# EAGLE design Pure VCO (EAGLE 9.6.2)

## Sheet 1 of 6: Core
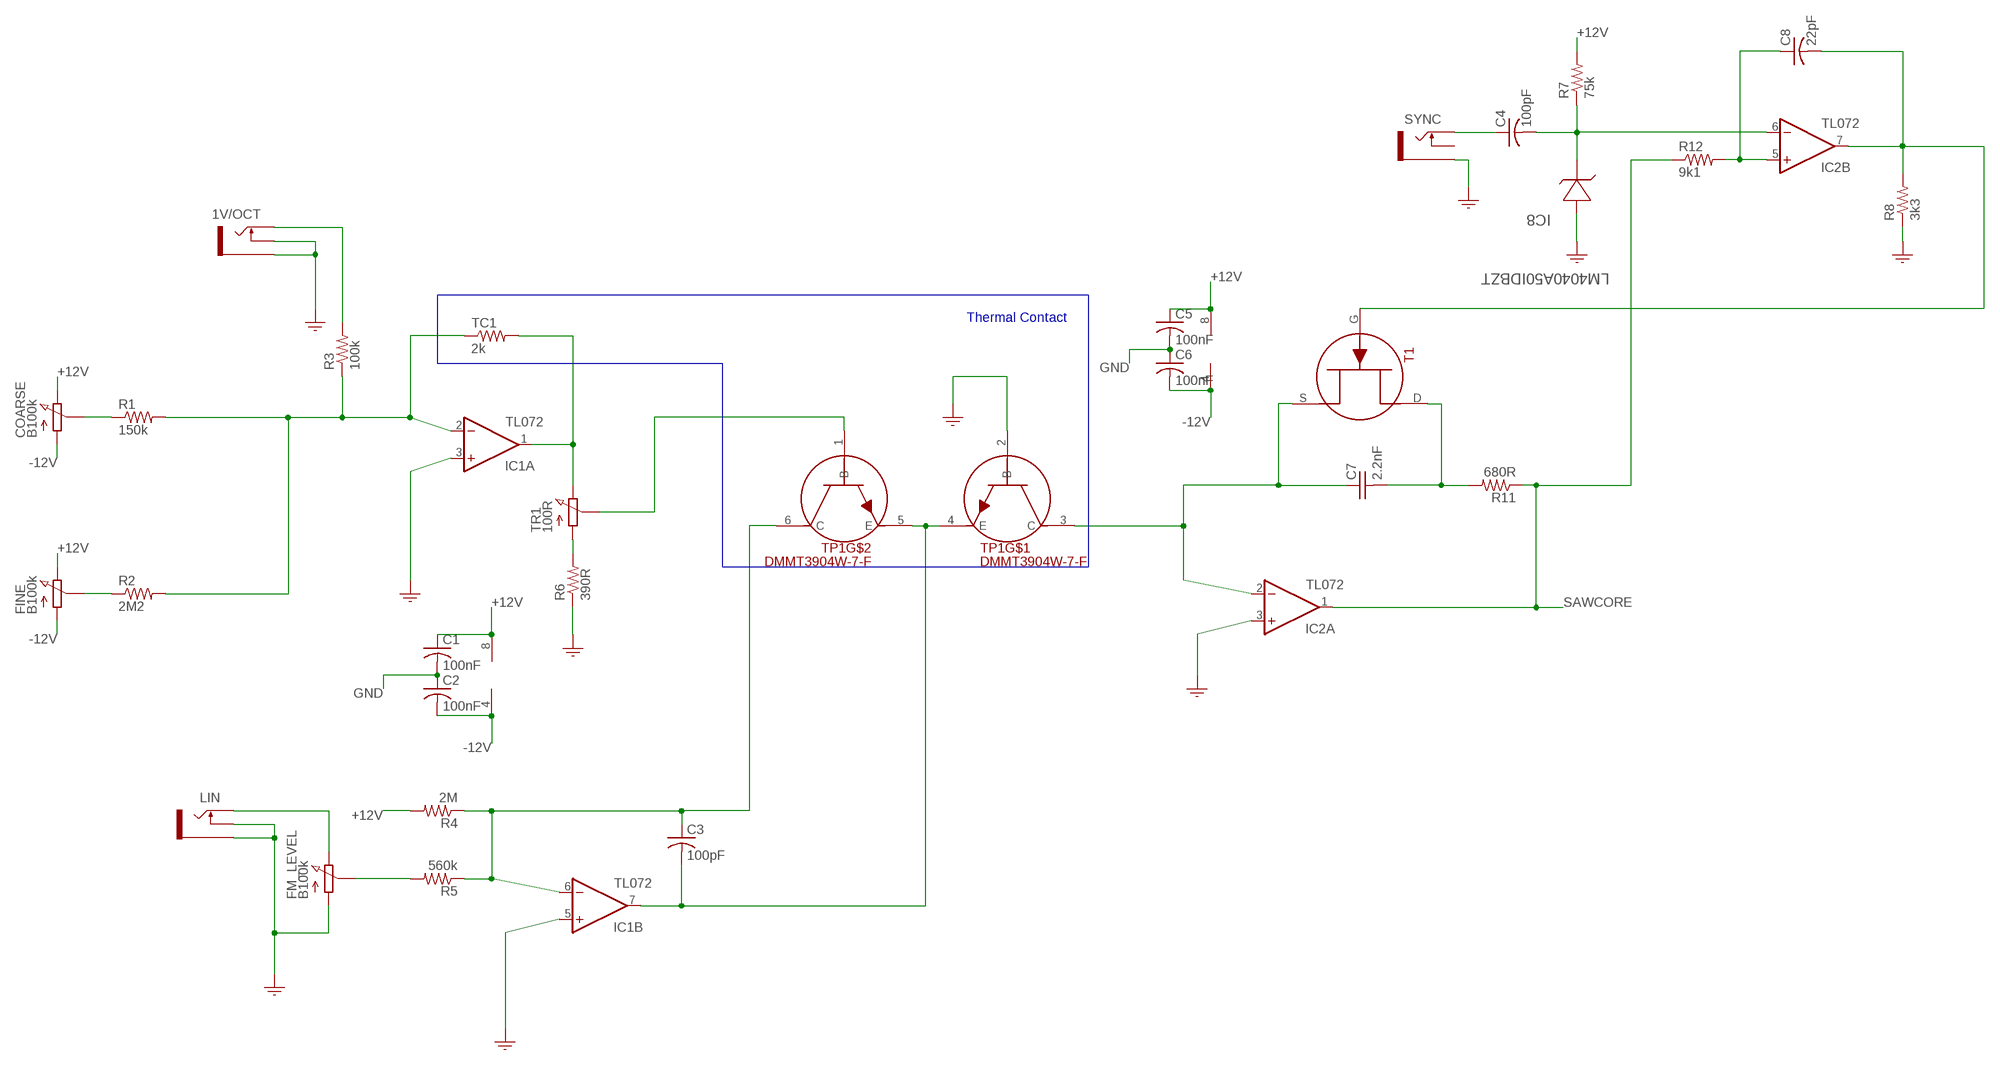
[diagram p0: schematic, sheet 1]

### Parts
1V/OCT  PJ301M-12  SOCKET_MONO_3.5MMPJ301M-12  [PJ301M-12]
C1  100nF  CAPACITOR-USC0805  [C0805]
C2  100nF  CAPACITOR-USC0805  [C0805]
C3  100pF  CAPACITOR-USC0805  [C0805]
C4  100pF  CAPACITOR-USC0805  [C0805]
C5  100nF  CAPACITOR-USC0805  [C0805]
C6  100nF  CAPACITOR-USC0805  [C0805]
C7  2.2nF  CAPACITOR_POLYFILM  [POLY_CAP]
C8  22pF  CAPACITOR-USC0805  [C0805]
COARSE  B100k  RESISTOR_VARIABLEPOT_9MM_RED_KNOB  [POT_9MM_RED_KNOB]
FINE  B100k  RESISTOR_VARIABLEPOT_9MM_RED_MXR_KNOB  [POT_9MM_RED_MXR_KNOB]
FM_LEVEL  B100k  RESISTOR_VARIABLEPOT_9MM_GREEN_KNOB  [POT_9MM_GREEN_KNOB]
IC1  TL072  OPAMP_DUALD  [SO08]
IC2  TL072  OPAMP_DUALD  [SO08]
IC8  LM4040A50IDBZT  VOLTAGE_REF  [SOT95P237X112-3N]
LIN  PJ301M-12  SOCKET_MONO_3.5MMPJ301M-12  [PJ301M-12]
R1  150k  RESISTOR_USR0805  [R0805]
R2  2M2  RESISTOR_USR0805  [R0805]
R3  100k  RESISTOR_USR0805  [R0805]
R4  2M  RESISTOR_USR0805  [R0805]
R5  560k  RESISTOR_USR0805  [R0805]
R6  390R  RESISTOR_USR0805  [R0805]
R7  75k  RESISTOR_USR0805  [R0805]
R8  3k3  RESISTOR_USR0805  [R0805]
R11  680R  RESISTOR_USR0805  [R0805]
R12  9k1  RESISTOR_USR0805  [R0805]
SYNC  PJ301M-12  SOCKET_MONO_3.5MMPJ301M-12  [PJ301M-12]
T1  MMBFJ309  TRANSISTOR_JFET_N_CHN  [N_CHN]
TC1  2k  RESISTOR_US0207/8.5  [0207/8.5]
TP1  DMMT3904W-7-F  TRANSISTOR_PAIR_NPN  [TRANS_PAIR]
TR1  100R  RESISTOR_VARIABLETRIMMER_TH  [TRIMMER_TH]

### Nets
+12V: C1.1 C5.1 COARSE.P$3 FINE.P$3 IC1.8(P:V+) IC2.8(P:V+) R4.2 R7.2 ; also sheet 2,3,4,5,6
-12V: C2.2 C6.2 COARSE.P$1 FINE.P$1 IC1.4(P:V-) IC2.4(P:V-) ; also sheet 2,3,4,5,6
GND: 1V/OCT.GND(SLEEVE) 1V/OCT.NORM(SWITCH) C1.2 C2.1 C5.2 C6.1 FM_LEVEL.P$1 IC1.3(A:+IN) IC1.5(B:+IN) IC2.3(A:+IN) IC8.2(ANODE) LIN.GND(SLEEVE) LIN.NORM(SWITCH) R6.1 R8.1 SYNC.GND(SLEEVE) TP1.2(B) ; also sheet 2,3,4,5,6
N$2: COARSE.P$2 R1.1
N$4: IC1.2(A:-IN) R1.2 R2.2 R3.1 TC1.1
N$5: FINE.P$2 R2.1
N$7: IC1.1(A:OUT) TC1.2 TR1.3
N$8: R6.2 TR1.1
N$9: 1V/OCT.TIP R3.2
N$10: TP1.1(B) TR1.2
N$11: C7.2(-) R11.2 T1.D
N$12: C3.1 IC1.6(B:-IN) R4.1 R5.1 TP1.6(C)
N$13: C7.1(+) IC2.2(A:-IN) T1.S TP1.3(C)
N$15: FM_LEVEL.P$3 LIN.TIP
N$16: C8.1 IC2.5(B:+IN) R12.2
N$17: FM_LEVEL.P$2 R5.2
N$18: C3.2 IC1.7(B:OUT) TP1.4(E) TP1.5(E)
N$20: C8.2 IC2.7(B:OUT) R8.2 T1.G
N$21: C4.1 SYNC.TIP
N$22: C4.2 IC2.6(B:-IN) IC8.1(CATHODE) R7.1
SAWCORE: IC2.1(A:OUT) R11.1 R12.1 ; also sheet 2
Unconnected: IC8.3(NC) SYNC.NORM(SWITCH)

### Buses
B$1

### Notes on the sheet
- Thermal Contact

## Sheet 2 of 6: Saw and Triangle Shaping
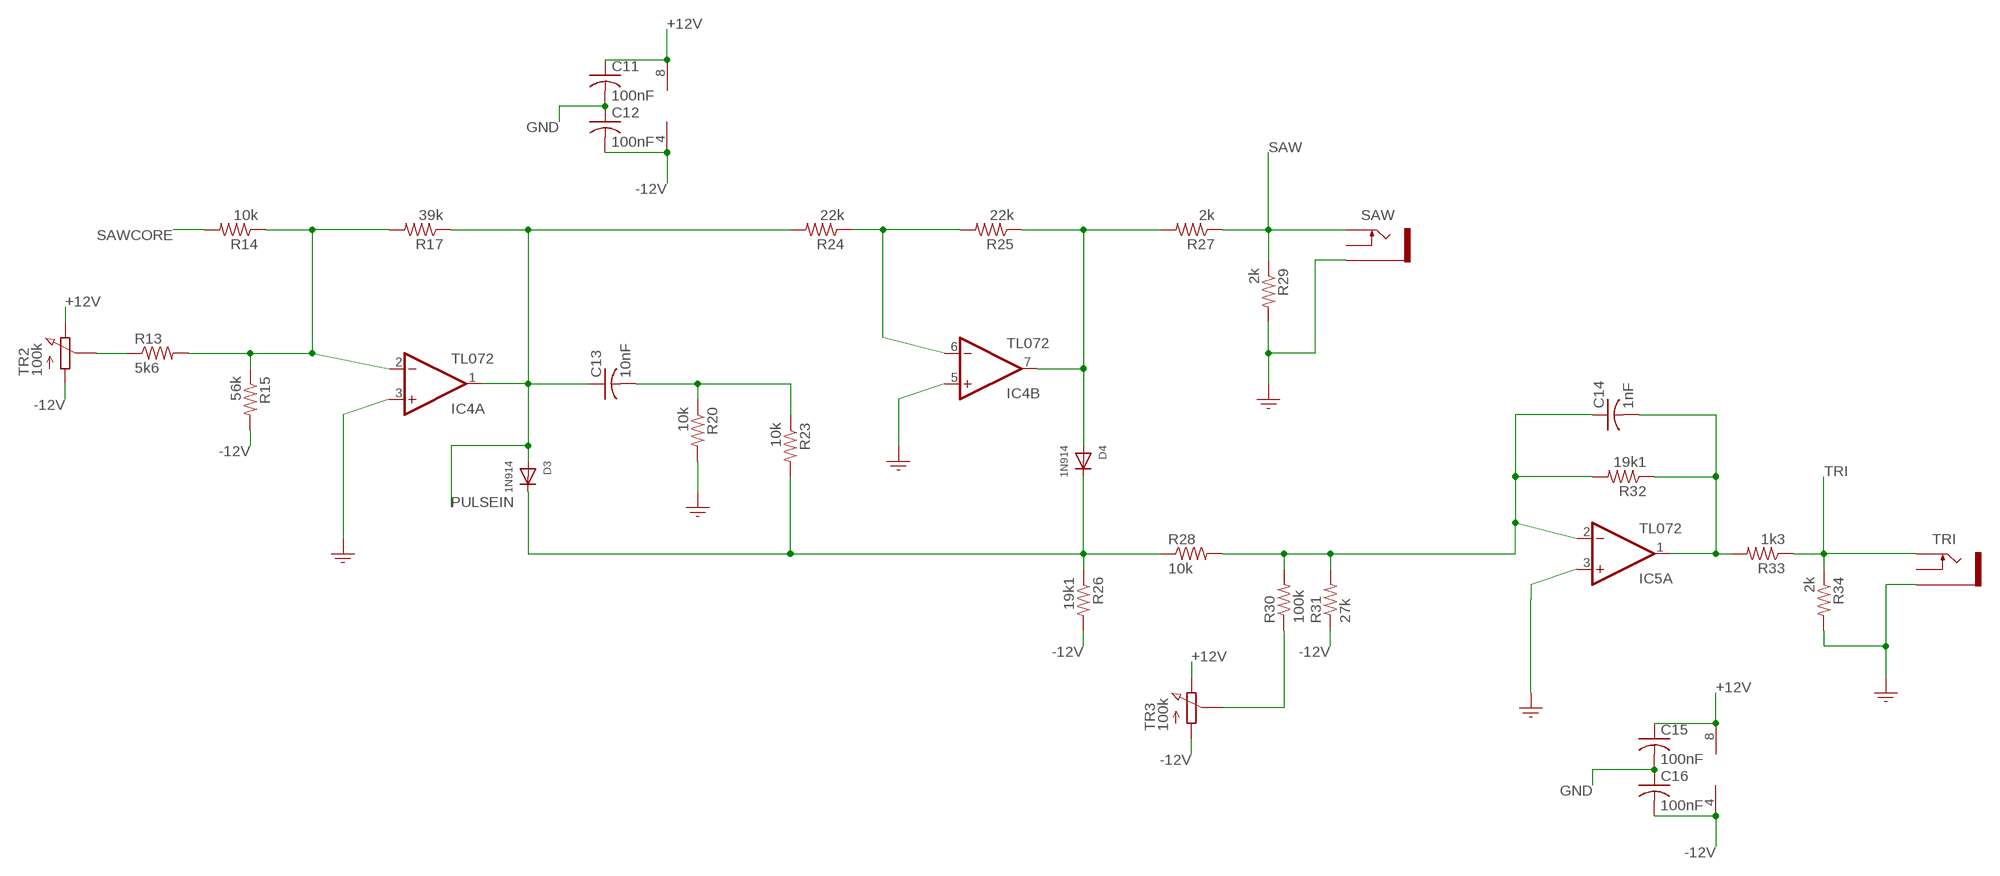
[diagram p1: schematic, sheet 2]

### Parts
C11  100nF  CAPACITOR-USC0805  [C0805]
C12  100nF  CAPACITOR-USC0805  [C0805]
C13  10nF  CAPACITOR-USC0805  [C0805]
C14  1nF  CAPACITOR-USC0805  [C0805]
C15  100nF  CAPACITOR-USC0805  [C0805]
C16  100nF  CAPACITOR-USC0805  [C0805]
D3  1N914  DIODESOD-323F  [SOD-323F]
D4  1N914  DIODESOD-323F  [SOD-323F]
IC4  TL072  OPAMP_DUALD  [SO08]
IC5  TL072  OPAMP_DUALD  [SO08]
R13  5k6  RESISTOR_USR0805  [R0805]
R14  10k  RESISTOR_USR0805  [R0805]
R15  56k  RESISTOR_USR0805  [R0805]
R17  39k  RESISTOR_USR0805  [R0805]
R20  10k  RESISTOR_USR0805  [R0805]
R23  10k  RESISTOR_USR0805  [R0805]
R24  22k  RESISTOR_USR0805  [R0805]
R25  22k  RESISTOR_USR0805  [R0805]
R26  19k1  RESISTOR_USR0805  [R0805]
R27  2k  RESISTOR_USR0805  [R0805]
R28  10k  RESISTOR_USR0805  [R0805]
R29  2k  RESISTOR_USR0805  [R0805]
R30  100k  RESISTOR_USR0805  [R0805]
R31  27k  RESISTOR_USR0805  [R0805]
R32  19k1  RESISTOR_USR0805  [R0805]
R33  1k3  RESISTOR_USR0805  [R0805]
R34  2k  RESISTOR_USR0805  [R0805]
SAW  PJ301M-12  SOCKET_MONO_3.5MMPJ301M-12  [PJ301M-12]
TR2  100k  RESISTOR_VARIABLETRIMMER_TH  [TRIMMER_TH]
TR3  100k  RESISTOR_VARIABLETRIMMER_TH  [TRIMMER_TH]
TRI  PJ301M-12  SOCKET_MONO_3.5MMPJ301M-12  [PJ301M-12]

### Nets
+12V: C11.1 C15.1 IC4.8(P:V+) IC5.8(P:V+) TR2.3 TR3.3 ; also sheet 1,3,4,5,6
-12V: C12.2 C16.2 IC4.4(P:V-) IC5.4(P:V-) R15.2 R26.2 R31.1 TR2.1 TR3.1 ; also sheet 1,3,4,5,6
GND: C11.2 C12.1 C15.2 C16.1 IC4.3(A:+IN) IC4.5(B:+IN) IC5.3(A:+IN) R20.2 R29.2 R34.2 SAW.GND(SLEEVE) TRI.GND(SLEEVE) ; also sheet 1,3,4,5,6
N$23: R13.1 TR2.2
N$24: IC4.2(A:-IN) R13.2 R14.1 R15.1 R17.2
N$28: C13.2 R20.1 R23.1
N$29: R30.1 TR3.2
N$30: IC4.6(B:-IN) R24.1 R25.2
N$31: D4.A IC4.7(B:OUT) R25.1 R27.2
N$33: D3.C D4.C R23.2 R26.1 R28.1
N$34: C14.1 IC5.2(A:-IN) R28.2 R30.2 R31.2 R32.2
N$37: C14.2 IC5.1(A:OUT) R32.1 R33.2
PULSEIN: C13.1 D3.A IC4.1(A:OUT) R17.1 R24.2 ; also sheet 3
SAW: R27.1 R29.1 SAW.TIP ; also sheet 5
SAWCORE: R14.2 ; also sheet 1
TRI: R33.1 R34.1 TRI.TIP ; also sheet 4,5
Unconnected: SAW.NORM(SWITCH) TRI.NORM(SWITCH)

## Sheet 3 of 6: Pulse and PWM Shaping
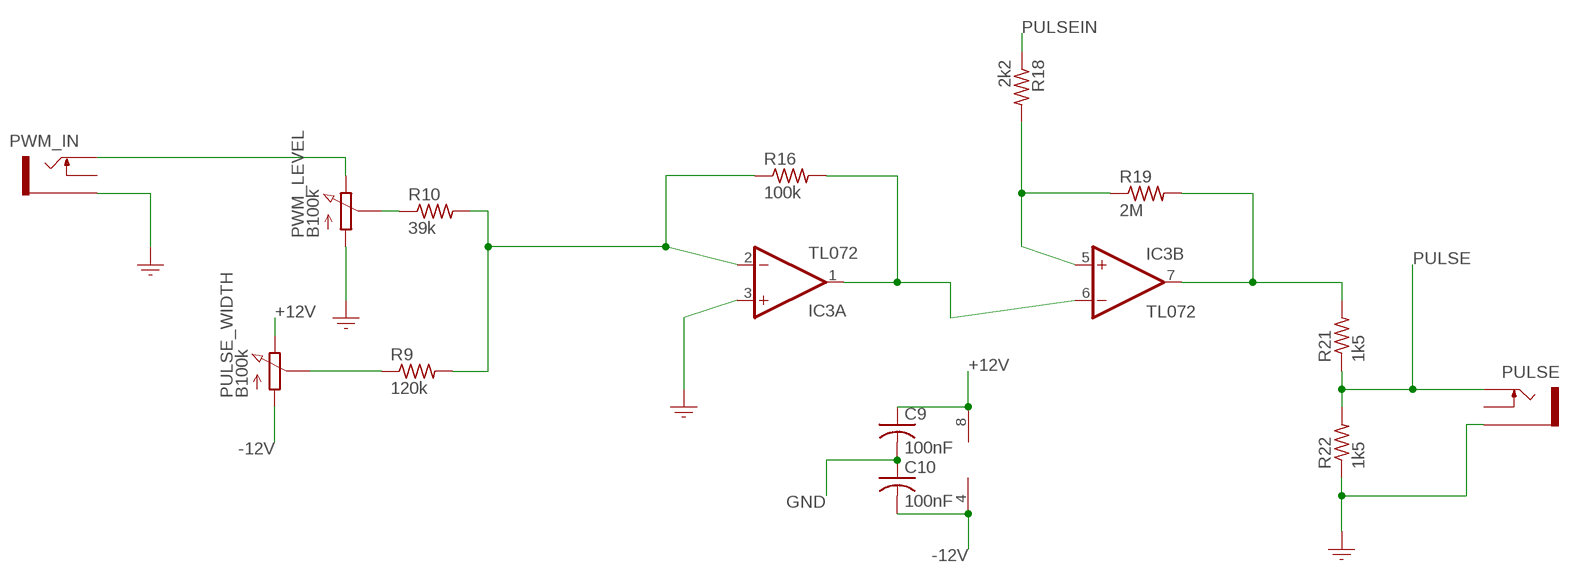
[diagram p2: schematic, sheet 3]

### Parts
C9  100nF  CAPACITOR-USC0805  [C0805]
C10  100nF  CAPACITOR-USC0805  [C0805]
IC3  TL072  OPAMP_DUALD  [SO08]
PULSE  PJ301M-12  SOCKET_MONO_3.5MMPJ301M-12  [PJ301M-12]
PULSE_WIDTH  B100k  RESISTOR_VARIABLEPOT_9MM_YELLOW_KNOB  [POT_9MM_YELLOW_KNOB]
PWM_IN  PJ301M-12  SOCKET_MONO_3.5MMPJ301M-12  [PJ301M-12]
PWM_LEVEL  B100k  RESISTOR_VARIABLEPOT_9MM_GREEN_KNOB  [POT_9MM_GREEN_KNOB]
R9  120k  RESISTOR_USR0805  [R0805]
R10  39k  RESISTOR_USR0805  [R0805]
R16  100k  RESISTOR_USR0805  [R0805]
R18  2k2  RESISTOR_USR0805  [R0805]
R19  2M  RESISTOR_USR0805  [R0805]
R21  1k5  RESISTOR_USR0805  [R0805]
R22  1k5  RESISTOR_USR0805  [R0805]

### Nets
+12V: C9.1 IC3.8(P:V+) PULSE_WIDTH.P$3 ; also sheet 1,2,4,5,6
-12V: C10.2 IC3.4(P:V-) PULSE_WIDTH.P$1 ; also sheet 1,2,4,5,6
GND: C9.2 C10.1 IC3.3(A:+IN) PULSE.GND(SLEEVE) PWM_IN.GND(SLEEVE) PWM_LEVEL.P$1 R22.1 ; also sheet 1,2,4,5,6
N$6: IC3.1(A:OUT) IC3.6(B:-IN) R16.2
N$36: IC3.5(B:+IN) R18.2 R19.1
N$39: IC3.7(B:OUT) R19.2 R21.2
N$40: PULSE_WIDTH.P$2 R9.1
N$41: PWM_IN.TIP PWM_LEVEL.P$3
N$42: IC3.2(A:-IN) R9.2 R10.2 R16.1
N$46: PWM_LEVEL.P$2 R10.1
PULSE: PULSE.TIP R21.1 R22.2 ; also sheet 5
PULSEIN: R18.1 ; also sheet 2
Unconnected: PULSE.NORM(SWITCH) PWM_IN.NORM(SWITCH)

## Sheet 4 of 6: Sine Shaping
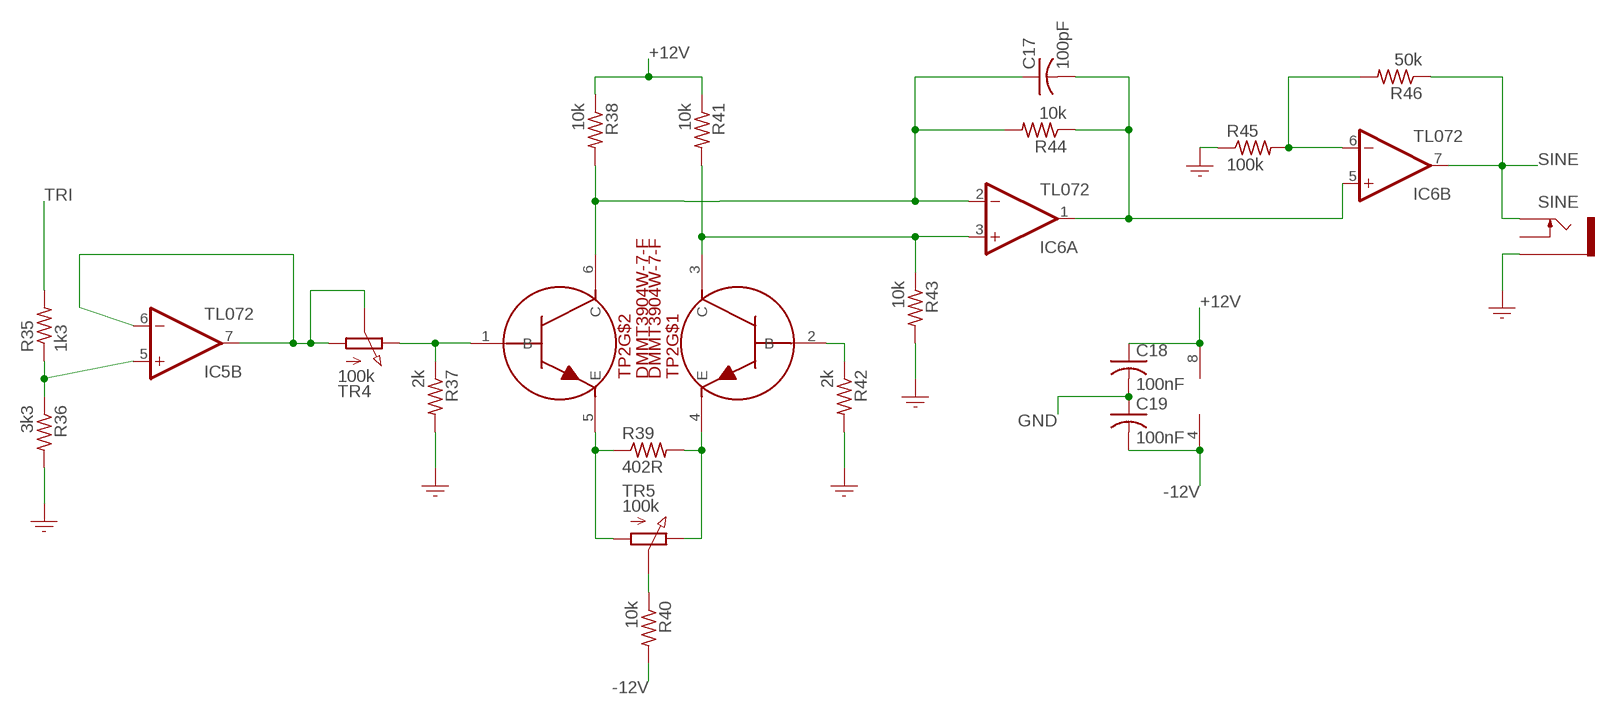
[diagram p3: schematic, sheet 4]

### Parts
C17  100pF  CAPACITOR-USC0805  [C0805]
C18  100nF  CAPACITOR-USC0805  [C0805]
C19  100nF  CAPACITOR-USC0805  [C0805]
IC6  TL072  OPAMP_DUALD  [SO08]
R35  1k3  RESISTOR_USR0805  [R0805]
R36  3k3  RESISTOR_USR0805  [R0805]
R37  2k  RESISTOR_USR0805  [R0805]
R38  10k  RESISTOR_USR0805  [R0805]
R39  402R  RESISTOR_USR0805  [R0805]
R40  10k  RESISTOR_USR0805  [R0805]
R41  10k  RESISTOR_USR0805  [R0805]
R42  2k  RESISTOR_USR0805  [R0805]
R43  10k  RESISTOR_USR0805  [R0805]
R44  10k  RESISTOR_USR0805  [R0805]
R45  100k  RESISTOR_USR0805  [R0805]
R46  50k  RESISTOR_USR0805  [R0805]
SINE  PJ301M-12  SOCKET_MONO_3.5MMPJ301M-12  [PJ301M-12]
TP2  DMMT3904W-7-F  TRANSISTOR_PAIR_NPN  [TRANS_PAIR]
TR4  100k  RESISTOR_VARIABLETRIMMER_TH  [TRIMMER_TH]
TR5  100k  RESISTOR_VARIABLETRIMMER_TH  [TRIMMER_TH]

### Nets
+12V: C18.1 IC6.8(P:V+) R38.1 R41.1 ; also sheet 1,2,3,5,6
-12V: C19.2 IC6.4(P:V-) R40.2 ; also sheet 1,2,3,5,6
GND: C18.2 C19.1 R36.2 R37.2 R42.2 R43.2 R45.1 SINE.GND(SLEEVE) ; also sheet 1,2,3,5,6
N$14: C17.1 IC6.2(A:-IN) R38.2 R44.2 TP2.6(C)
N$19: IC5.6(B:-IN) IC5.7(B:OUT) TR4.1 TR4.2
N$76: R37.1 TP2.1(B) TR4.3
N$77: R39.1 TP2.5(E) TR5.1
N$78: R39.2 TP2.4(E) TR5.3
N$79: R40.1 TR5.2
N$80: R42.1 TP2.2(B)
N$82: IC6.3(A:+IN) R41.2 R43.1 TP2.3(C)
N$83: IC5.5(B:+IN) R35.1 R36.1
N$84: IC6.6(B:-IN) R45.2 R46.2
SINE: IC6.7(B:OUT) R46.1 SINE.TIP ; also sheet 5
SINE_PRE1: C17.2 IC6.1(A:OUT) IC6.5(B:+IN) R44.1
TRI: R35.2 ; also sheet 2,5
Unconnected: SINE.NORM(SWITCH)

## Sheet 5 of 6: Mixer
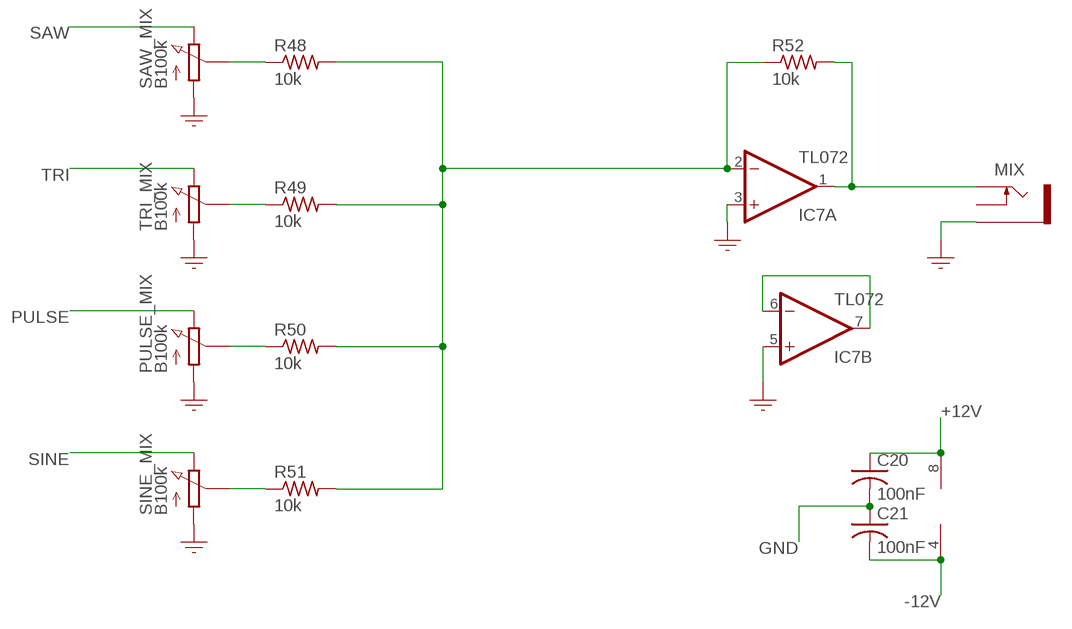
[diagram p4: schematic, sheet 5]

### Parts
C20  100nF  CAPACITOR-USC0805  [C0805]
C21  100nF  CAPACITOR-USC0805  [C0805]
IC7  TL072  OPAMP_DUALD  [SO08]
MIX  PJ301M-12  SOCKET_MONO_3.5MMPJ301M-12  [PJ301M-12]
PULSE_MIX  B100k  RESISTOR_VARIABLEPOT_9MM_BLUE_KNOB  [POT_9MM_BLUE_KNOB]
R48  10k  RESISTOR_USR0805  [R0805]
R49  10k  RESISTOR_USR0805  [R0805]
R50  10k  RESISTOR_USR0805  [R0805]
R51  10k  RESISTOR_USR0805  [R0805]
R52  10k  RESISTOR_USR0805  [R0805]
SAW_MIX  B100k  RESISTOR_VARIABLEPOT_9MM_BLUE_KNOB  [POT_9MM_BLUE_KNOB]
SINE_MIX  B100k  RESISTOR_VARIABLEPOT_9MM_BLUE_KNOB  [POT_9MM_BLUE_KNOB]
TRI_MIX  B100k  RESISTOR_VARIABLEPOT_9MM_BLUE_KNOB  [POT_9MM_BLUE_KNOB]

### Nets
+12V: C20.1 IC7.8(P:V+) ; also sheet 1,2,3,4,6
-12V: C21.2 IC7.4(P:V-) ; also sheet 1,2,3,4,6
GND: C20.2 C21.1 IC7.3(A:+IN) IC7.5(B:+IN) MIX.GND(SLEEVE) PULSE_MIX.P$1 SAW_MIX.P$1 SINE_MIX.P$1 TRI_MIX.P$1 ; also sheet 1,2,3,4,6
N$25: IC7.6(B:-IN) IC7.7(B:OUT)
N$38: R48.1 SAW_MIX.P$2
N$43: R49.1 TRI_MIX.P$2
N$44: PULSE_MIX.P$2 R50.1
N$45: R51.1 SINE_MIX.P$2
N$48: IC7.2(A:-IN) R48.2 R49.2 R50.2 R51.2 R52.1
N$49: IC7.1(A:OUT) MIX.TIP R52.2
PULSE: PULSE_MIX.P$3 ; also sheet 3
SAW: SAW_MIX.P$3 ; also sheet 2
SINE: SINE_MIX.P$3 ; also sheet 4
TRI: TRI_MIX.P$3 ; also sheet 2,4
Unconnected: MIX.NORM(SWITCH)

## Sheet 6 of 6: Power
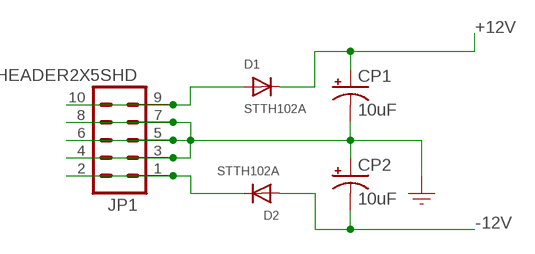
[diagram p5: schematic, sheet 6]

### Parts
CP1  10uF  CAPACITOR_POL-US153CLV-0505  [153CLV-0505]
CP2  10uF  CAPACITOR_POL-US153CLV-0505  [153CLV-0505]
D1  STTH102A  DIODESMA  [SMADIODE]
D2  STTH102A  DIODESMA  [SMADIODE]
JP1  HEADER2X5SHD  [2X5-SHROUDED]

### Nets
+12V: CP1.+ D1.C ; also sheet 1,2,3,4,5
-12V: CP2.- D2.A ; also sheet 1,2,3,4,5
GND: CP1.- CP2.+ JP1.3 JP1.4 JP1.5 JP1.6 JP1.7 JP1.8 ; also sheet 1,2,3,4,5
N$1: D1.A JP1.9 JP1.10
N$3: D2.C JP1.1 JP1.2

## Library data of the parts
1V/OCT LIN MIX PULSE PWM_IN SAW SINE SYNC TRI = GMSN:SOCKET_MONO_3.5MM: 3.5 mm Jack Socket; SORT: 8
C1-C6 C8-C21 = GMSN:CAPACITOR-US: Capacitor; SORT: 3
C7 = GMSN:CAPACITOR_POLYFILM: Poly Film Capacitor; SORT: 7
COARSE FINE FM_LEVEL PULSE_MIX PULSE_WIDTH PWM_LEVEL SAW_MIX SINE_MIX TRI_MIX = GMSN:RESISTOR_VARIABLE: Trimmer Pot
CP1 CP2 = GMSN:CAPACITOR_POL-US: Electro Capacitor; SORT: 3
D1-D4 = GMSN:DIODE: Diode SMADIODE - SMA Surface Mount Package 20V 1A Schottky Diode Digikey: 641-1014-6-ND DO-1N4148 - Through Hole Small Current Diode SOD-123 20V 1 A (.5mV Vf) Schottky Diode - Digikey: MBRX120TPMSCT-ND SOD-323 10V 570mA (.38mV Vf, 3ns) Schottky Diode - Digikey: ZLLS410CT-ND SOD-523 30V 30mA Schottky Diode (RB751S-40TE61) - Digikey: RB751S-40TE61CT-ND SOT23-R/W - SOT23 Package (R = Solder Paste/Reflow Ovens, W = Hand-Soldering) BAT54Film 40V 300mA - Digikey: 497-7162-1-ND; SORT: 3.9
IC1-IC7 = GMSN:OPAMP_DUAL: Dual Op Amp; SORT: 4.5
IC8 = GMSN:VOLTAGE_REF: Shunt Voltage Reference; SORT: 4
JP1 = GMSN:HEADER2X5: Header 5x2 Standard 10-pin dual row 0.1" header. Commonly used with AVR-ISP. Use with Spark Fun Electronics SKU: PRT-00778; SORT: 7
R1-R46 R48-R52 TC1 = GMSN:RESISTOR_US: Resistor; SORT: 2
T1 = GMSN:TRANSISTOR_JFET_N_CHN: N Channel JFET; SORT: 4
TP1 TP2 = GMSN:TRANSISTOR_PAIR_NPN: NPN Transistor Matched Pair; SORT: 4
TR1-TR5 = GMSN:RESISTOR_VARIABLE: Trimmer Pot; SORT: 7

## Board
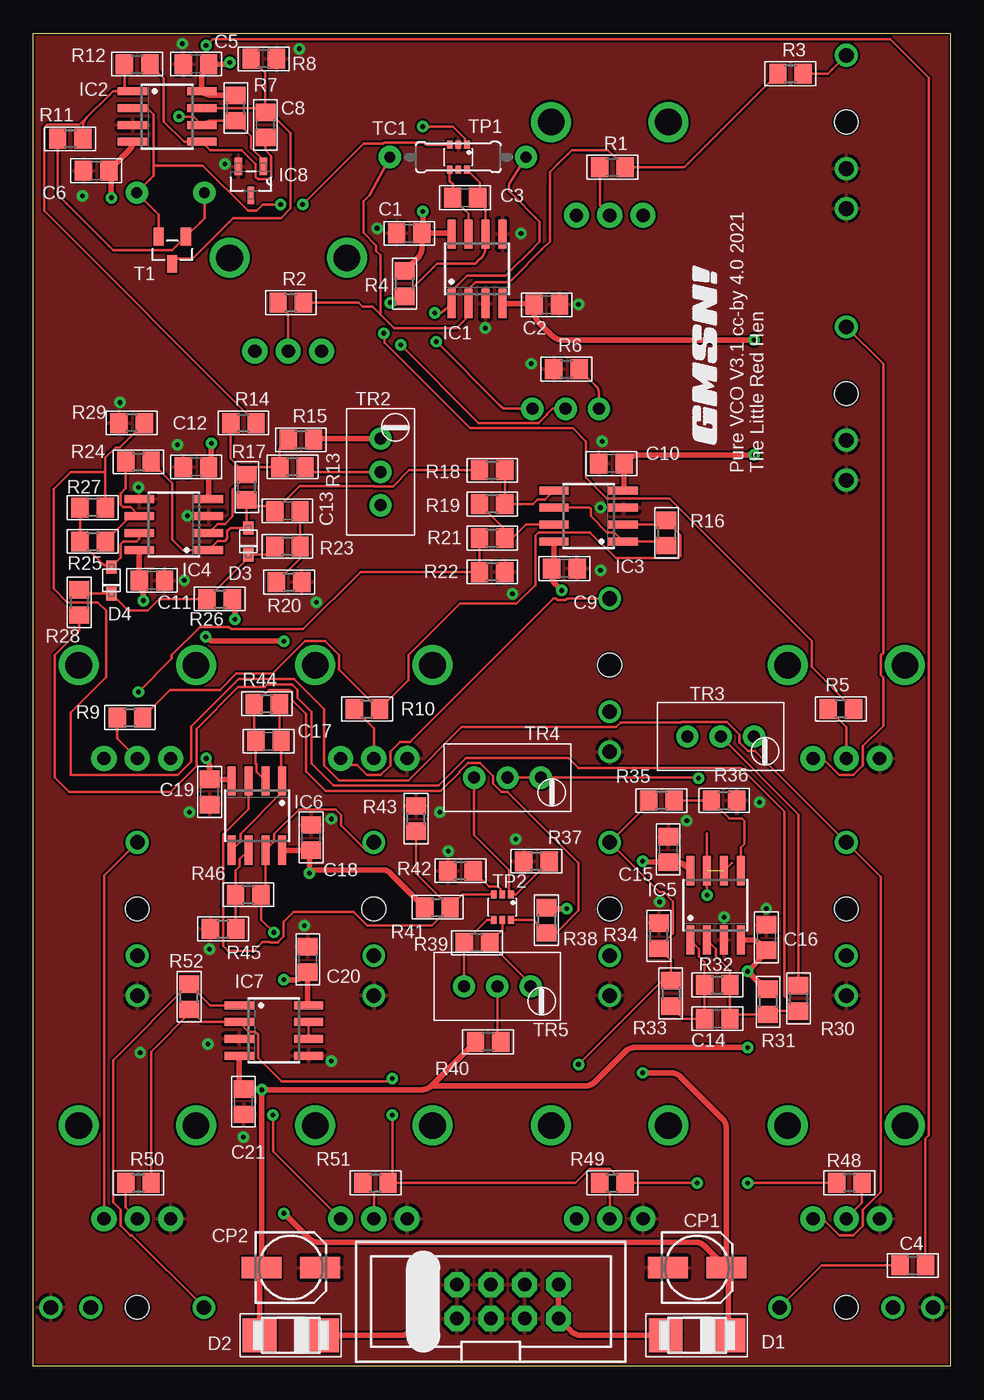
[diagram p6: board, top side]
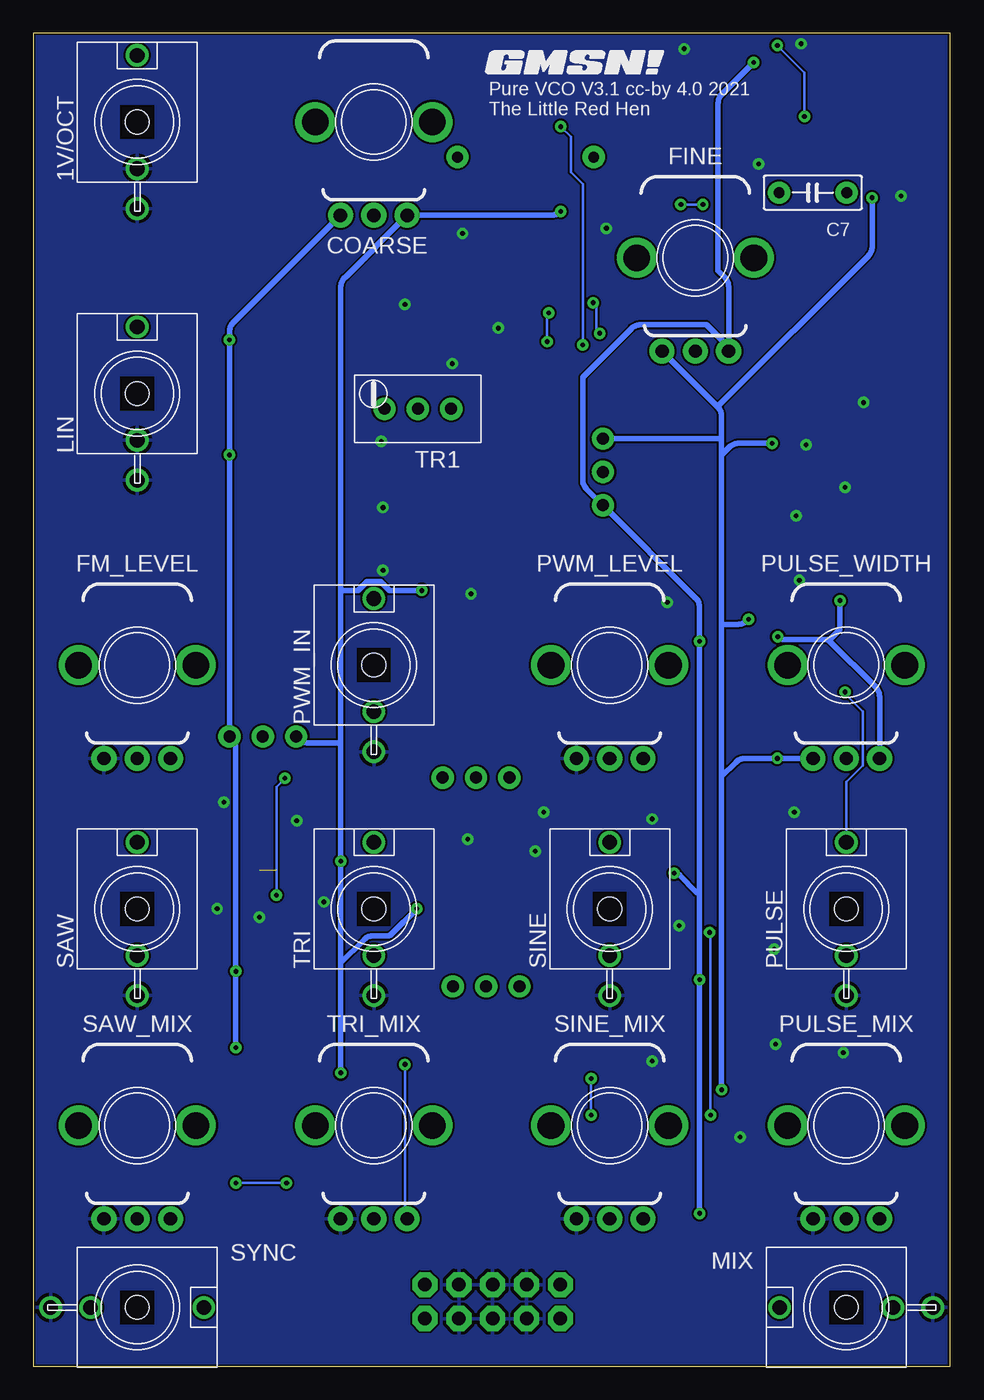
[diagram p7: board, bottom side, seen from below]

Size 68.8 x 100 mm. Coordinates in mm from the lower left corner, seen from the top.
Outline: 68.8,0 0,0 0,100 68.8,100 68.8,0
Copper layers (1*16): Top 0.035mm / dielectric 1.5mm / Bottom 0.035mm
Design rules "PCBWay": minimum track width 6mil, minimum drill 12mil, track to track 6mil, track to pad 6mil, pad to pad 6mil, via to via 6mil, smd to smd 6mil, copper to edge 6mil, drill to drill 6mil, minimum pad ring 12mil, minimum via ring 10mil, stop-mask expansion 4mil, vias tented up to drill 25mil, thermal gap 10mil

### Footprints (pad centres in the part's own frame; a part is rotated, then mirrored left to right if it is on the bottom)
PJ301M-12 = drill 1.1: GND 0,-6.5; NORM 0,-3.5; TIP 0,5 | hole 1.778: 0,0
C0805 = smd 1.3 x 1.5: 1 -0.95,0; 2 0.95,0
POLY_CAP = drill 0.813 pad 1.676: 1 -2.54,0; 2 2.54,0
POT_9MM_RED_KNOB = drill 1 pad 1.88: P$1 -2.5,-7; P$2 0,-7; P$3 2.5,-7 | drill 2 pad 2.68: P$4 -4.4,0; P$5 4.4,0
153CLV-0505 = smd 3 x 1.6: + 2.2,0; - -2.2,0
SMADIODE = smd 2.54 x 2.54: A 2.349,0; C -2.349,0
SOD-323F = smd 1 x 0.8: A -1,0; C 1,0
POT_9MM_RED_MXR_KNOB = drill 1 pad 1.88: P$1 -2.5,-7; P$2 0,-7; P$3 2.5,-7 | drill 2 pad 2.68: P$4 -4.4,0; P$5 4.4,0
POT_9MM_GREEN_KNOB = drill 1 pad 1.88: P$1 -2.5,-7; P$2 0,-7; P$3 2.5,-7 | drill 2 pad 2.68: P$4 -4.4,0; P$5 4.4,0
SO08 = smd 0.6 x 2.2: 1 -1.905,-2.6; 2 -0.635,-2.6; 3 0.635,-2.6; 4 1.905,-2.6; 5 1.905,2.6; 6 0.635,2.6; 7 -0.635,2.6; 8 -1.905,2.6
SOT95P237X112-3N = smd 1.321 x 0.559: 1 -1.092,0.94; 2 -1.092,-0.94 | smd 1.321 x 0.508: 3 1.092,0
2X5-SHROUDED = drill 1.016 pad 1.88 octagon: 1 -1.27,5.08; 2 1.27,5.08; 3 -1.27,2.54; 4 1.27,2.54; 5 -1.27,0; 6 1.27,0; 7 -1.27,-2.54; 8 1.27,-2.54; 9 -1.27,-5.08; 10 1.27,-5.08
POT_9MM_BLUE_KNOB = drill 1 pad 1.88: P$1 -2.5,-7; P$2 0,-7; P$3 2.5,-7 | drill 2 pad 2.68: P$4 -4.4,0; P$5 4.4,0
POT_9MM_YELLOW_KNOB = drill 1 pad 1.88: P$1 -2.5,-7; P$2 0,-7; P$3 2.5,-7 | drill 2 pad 2.68: P$4 -4.4,0; P$5 4.4,0
R0805 = smd 1.3 x 1.5: 1 -0.95,0; 2 0.95,0
N_CHN = smd 0.762 x 1.321: D -1.016,-1.016; G 0,1.016; S 1.016,-1.016
0207/8.5 = drill 0.813 pad 1.676: 1 -5.139,0; 2 5.08,0
TRANS_PAIR = smd 0.42 x 0.6: 1 -0.65,-0.95; 2 0,-0.95; 3 0.65,-0.95; 4 0.65,0.95; 5 0,0.95; 6 -0.65,0.95
TRIMMER_TH = drill 0.9 pad 1.676: 1 -0.802,1.143; 2 -3.302,1.143; 3 -5.802,1.143

### Placement (x,y rotation side)
1V/OCT  61,93.35 0 bottom
C1  28.21,85 180 top
C2  38.53,79.63 180 top
C3  32.4,87.66 180 top
C4  65.99,7.56 0 top
C5  12.21,97.7 180 top
C6  4.71,89.7 0 top
C7  10.3,88.04 180 bottom
C8  17.41,93.12 90 top
C9  39.86,59.85 0 top
C10  43.39,67.72 0 top
C11  8.91,58.96 0 top
C12  12.21,67.47 0 top
C13  19.07,64.17 0 top
C14  51.32,26.07 180 top
C15  47.64,38.77 90 top
C16  55.01,32.16 270 top
C17  17.65,46.9 0 top
C18  20.84,39.66 90 top
C19  13.22,43.09 90 top
C20  20.59,30.51 90 top
C21  15.76,19.85 90 top
COARSE  43.25,93.35 0 bottom
CP1  49.8,7.4 0 top
CP2  19.32,7.4 0 top
D1  49.8,2.32 180 top
D2  19.32,2.32 180 top
D3  16.14,61.88 270 top
D4  5.86,58.96 270 top
FINE  19.12,83.16 0 bottom
FM_LEVEL  61,52.6 0 bottom
IC1  33.29,82.33 0 top
IC2  10.05,93.76 270 top
IC3  41.67,63.79 90 top
IC4  10.56,63.15 90 top
IC5  51.2,34.58 0 top
IC6  16.78,41.31 180 top
IC7  18.05,25.18 270 top
IC8  16.33,88.92 270 top
JP1  34.33,4.84 90 top
LIN  61,72.97 0 bottom
MIX  7.8,4.4 90 bottom
PULSE  7.8,34.3 0 bottom
PULSE_MIX  7.8,18.06 0 bottom
PULSE_WIDTH  7.8,52.6 0 bottom
PWM_IN  43.25,52.6 0 bottom
PWM_LEVEL  25.55,52.6 0 bottom
R1  43.45,89.95 0 top
R2  19.32,79.79 0 top
R3  56.82,96.97 0 top
R4  27.86,81.22 90 top
R5  60.59,49.31 180 top
R6  40.01,74.81 0 top
R7  15.19,94.39 90 top
R8  17.29,98.08 180 top
R9  7.26,48.68 0 top
R10  25.04,49.31 0 top
R11  2.78,92.08 180 top
R12  7.79,97.7 0 top
R13  19.45,67.47 180 top
R14  15.76,70.77 0 top
R15  20.08,69.5 0 top
R16  47.51,62.52 270 top
R17  16.02,65.95 90 top
R18  34.43,67.22 0 top
R19  34.43,64.68 180 top
R20  19.19,58.84 0 top
R21  34.43,62.14 0 top
R22  34.43,59.6 180 top
R23  19.07,61.5 180 top
R24  7.89,67.85 0 top
R25  4.46,61.88 0 top
R26  13.99,57.57 0 top
R27  4.46,64.42 180 top
R28  3.45,57.31 270 top
R29  7.38,70.77 180 top
R30  57.42,27.59 270 top
R31  55.13,27.34 270 top
R32  51.32,28.61 0 top
R33  47.83,27.97 270 top
R34  46.94,32.29 90 top
R35  47.13,42.43 180 top
R36  51.83,42.44 0 top
R37  37.76,37.88 180 top
R38  38.51,33.46 270 top
R39  33.29,31.76 180 top
R40  34.13,24.34 180 top
R41  30.32,34.43 0 top
R42  32.05,37.17 180 top
R43  28.72,41.08 90 top
R44  17.52,49.69 180 top
R45  14.24,32.8 0 top
R46  16.13,35.37 180 top
R48  61.23,13.75 180 top
R49  43.45,13.75 0 top
R50  7.89,13.75 0 top
R51  25.67,13.75 0 top
R52  11.7,27.72 90 top
SAW  61,34.3 0 bottom
SAW_MIX  61,18.06 0 bottom
SINE  25.55,34.3 0 bottom
SINE_MIX  25.55,18.06 0 bottom
SYNC  61,4.4 270 bottom
T1  10.43,83.73 180 top
TC1  31.89,90.71 0 top
TP1  31.89,90.71 180 top
TP2  35.2,34.43 180 top
TR1  43.25,72.97 180 bottom
TR2  27.19,70.39 90 top
TR3  54.88,46.1 0 top
TR4  38.88,43.01 0 top
TR5  38.12,27.35 0 top
TRI  43.25,34.3 0 bottom
TRI_MIX  43.25,18.06 0 bottom
U$1  [GMSN!_LOGO]  50.47,76.14 90 top
U$2  [GMSN!_LOGO]  27.89,97.73 0 bottom

### Tracks (layer width: path | path; a pad name or v marks a point on that pad's centre or on a via)
+12V  (via drill 0.35)
  Top 0.2: v12.93,54.73 12.93,54.68
  Top 0.406: D1.C 52.15,7.04 arc45 CP1.+ | CP1.+ 52,17.87 arc45 51.71,18.57 48.57,21.71 arc45 47.86,22.01 v45.74,22.01 | v29.23,86.65 29.23,85.16 arc-45 C1.1 | C1.1 31.22,85 arc-45 IC1.8 | C1.1 29.16,83.88 arc-45 28.87,83.17 R4.2 | v39.64,58.2 39.2,58.63 arc-45 38.91,59.34 C9.1 arc45 39.07,60.24 IC3.8 | v45.74,37.88 arc45 45.88,37.82 C15.1 48.24,37.82 arc-45 48.94,37.53 IC5.8 | v40.02,34.32 38.71,34.32 arc-45 R38.1 | CP1.+ 50.39,9.01 arc45 49.68,9.3 21.39,9.3 arc-45 20.68,9.6 v18.81,11.46 | v14.75,97.82 arc-45 14.44,97.7 C5.1 12.94,97.48 arc45 12.65,96.77 IC2.8 12.68,95.64 arc45 13.38,95.34 R7.2 | v18.81,54.39 13.64,54.39 arc-45 12.93,54.68 | IC4.8 arc45 IC4.8 C11.1 7.96,58.8 arc45 8.25,58.1 8.25,57.46 v8.27,57.44 | IC6.8 arc45 IC6.8 C18.1 arc45 20.72,38.4 v20.72,36.99 arc-45 21.33,37.25 26.18,37.25 arc-45 26.82,36.98 R41.1 | v18.81,28.99 19.6,28.99 arc45 20.31,29.28 C20.1 20.59,27.23 arc45 IC7.8
  Bottom 0.406: v45.74,22.01 45.74,30.26 | 45.74,30.26 45.74,35.34 v45.74,37.88 45.74,46.77 | 45.74,46.77 45.74,58.2 | 45.74,58.2 45.74,80.95 arc45 45.44,81.66 45.38,81.72 COARSE.P$3 29.94,86.35 arc-45 v29.23,86.64 v29.23,86.65 | 45.74,58.2 44.43,58.2 43.77,58.86 42.73,58.86 42.07,58.2 v39.64,58.2 | TR3.3 48.9,47.06 arc-45 48.19,46.77 45.74,46.77 | 45.74,30.26 44,32 arc45 43.29,32.29 42.18,32.29 arc-45 41.96,32.38 v40.02,34.32 | v18.81,11.46 v18.81,28.99 18.81,35.34 | 18.81,35.34 18.81,36.61 v18.81,54.39 18.81,56.94 arc-45 19.11,57.64 TR2.3 27.28,65.82 arc45 27.57,66.53 27.57,74.2 23.93,77.85 arc45 23.22,78.14 18.3,78.14 16.84,76.67 arc45 FINE.P$3 16.62,81 arc-45 16.92,81.71 17.41,82.2 17.41,94.74 arc45 17.12,95.45 v14.75,97.82 | PULSE_WIDTH.P$3 5.3,50.24 arc-45 5.59,50.95 9.1,54.45 | 9.1,54.45 9.16,54.52 12.41,54.52 arc45 v12.93,54.73 | 18.81,35.34 19.07,35.59 20.28,36.81 arc-45 v20.72,36.99 | v8.27,57.44 8.27,55.28 9.1,54.45
-12V  (via drill 0.35)
  Top 0.406: D2.A 16.97,7.04 arc-45 CP2.- 17.12,20.64 arc-45 v17.16,20.73 | v5.86,87.66 5.86,89.23 arc45 C6.2 7.18,91.21 arc45 IC2.4 | TR2.1 21.24,69.59 arc45 R15.2 | v13.35,69.25 13.35,67.94 arc-45 C12.2 IC4.4 arc-45 IC4.4 | v15.13,56.04 15.13,57.1 arc45 R26.2 | v12.97,45.6 arc-45 13.22,44.99 C19.2 14.57,44.04 arc-45 IC6.4 | v17.16,20.73 arc45 17.01,20.8 C21.2 15.74,20.82 arc-45 15.45,21.52 IC7.4 | R40.2 29.87,21.03 | 29.87,21.03 arc-45 29.16,20.73 v17.16,20.73 | 29.87,21.03 41.42,21.03 arc45 42.13,21.32 44.43,23.62 arc-45 45.13,23.91 v53.61,23.91 | v54.08,77 39.67,77 arc-45 38.97,77.29 37.87,78.38 arc-45 37.58,79.09 C2.2 arc45 37.34,79.73 IC1.4 | v54.08,68.36 45.39,68.36 arc45 44.68,68.07 C10.2 44.34,65.85 arc-45 IC3.4 | R31.1 arc-45 54.81,28.42 v53.61,29.62 54.87,30.89 arc45 C16.2 54.54,31.69 arc45 53.83,31.98 IC5.4
  Bottom 0.406: v17.16,20.73 17.16,40.42 17.16,44.23 | 17.16,44.23 17.16,54.39 17.16,55.66 | 17.16,55.66 17.16,68.36 | 17.16,68.36 17.16,69.63 | 17.16,69.63 17.16,71.28 arc-45 17.45,71.99 | 17.45,71.99 FINE.P$1 | 17.45,71.99 6.15,83.29 arc-45 5.86,84 v5.86,87.66 | 17.16,69.63 arc45 17.26,69.59 TR2.1 | 17.16,68.36 16.57,68.96 arc45 15.86,69.25 v13.35,69.25 | 17.16,55.66 15.92,55.66 arc-45 15.22,55.95 v15.13,56.04 | PULSE_WIDTH.P$1 v12.97,45.6 15.38,45.6 arc-45 16.08,45.31 17.16,44.23 | v53.61,23.91 v53.61,29.62 53.61,46.36 arc-45 53.9,47.07 TR3.1 v54.08,68.36 v54.08,77 54.08,77.61 arc45 53.78,78.31 COARSE.P$1
GND  (via drill 0.35)
  other vias: 3.7,87.79 11.19,99.22 19.95,98.84 14.37,90.2 36.59,85 33.92,77.88 40.91,79.66 37.35,75.22 25.8,85.38 42.69,69.38 42.56,59.72 42.56,64.42 35.96,57.95 6.49,72.3 10.81,69.12 21.23,57.31 11.32,58.96 11.57,63.79 11.7,41.56 22.37,41.05 30.5,41.56 31.13,38.64 20.34,33.05 8.02,23.53 15.76,17.18 22.37,22.89 36.21,39.53 47.01,34.83 54.5,42.33 51.83,33.69 55.01,34.32 7.89,65.95 49.04,40.93 13.22,31.28 13.1,24.16
  pour Top: 0.27,100.11 68.85,100.11 68.85,-0.22 0.27,-0.22
  pour Bottom: 0.27,100.11 68.85,100.11 68.85,-0.22 0.27,-0.22
N$1
  Top 0.406: D1.A 41.08,2.32 arc-45 40.37,2.61 JP1.9 JP1.10 | D1.A 48.53,2.32 D1.A
N$2
  Top 0.2: 42.5,87.51 42.5,87.1 42.79,86.81
  Top 0.203: R1.1 42.5,87.51 | 42.79,86.81 COARSE.P$2
N$3
  Top 0.406: D2.C 27.58,2.32 arc45 28.29,2.61 JP1.1 JP1.2
N$4
  Top 0.2: 24.78,85.03 25.73,84.08 25.73,83.66 26.05,83.35 26.05,82.33 | 24.4,79.79 24.69,79.5 25.45,79.5 | 26.69,78.27 27.07,77.88 27.48,77.88 | 31.38,77.88 31.77,77.88 32.21,78.33 | 35.34,81.31 35.7,81.31 35.96,81.57 | 38.18,83.79 38.75,84.36 38.75,84.78 | 39.39,90.2 38.75,89.57 38.75,88.68 | 48.44,89.95 48.85,89.95 49.14,90.24 | 40.11,90.93 40.4,91.22 40.82,91.22 | 42.72,91.22 43.13,91.22 43.42,90.93 | 25.23,87.85 24.78,87.41 24.78,87 | 32.87,81.02 33.16,81.31 33.58,81.31
  Top 0.203: TC1.1 25.23,87.85 | 26.05,82.33 26.05,78.9 | 25.45,79.5 26.05,78.9 | 24.4,79.79 R2.2 | 24.78,87 24.78,85.03 | 26.05,78.9 26.69,78.27 | 27.48,77.88 31.38,77.88 | 32.21,78.33 32.78,78.9 arc-45 32.66,79.21 IC1.2 32.66,80.63 arc-45 32.78,80.93 32.87,81.02 | 49.14,90.24 R3.1 | 48.44,89.95 R1.2 43.42,90.93 | 35.96,81.57 38.18,83.79 | 40.82,91.22 42.72,91.22 | 39.39,90.2 40.11,90.93 | 38.75,84.78 38.75,88.68 | 33.58,81.31 35.34,81.31
N$5
  Top 0.203: FINE.P$2 19.12,78.62 arc45 18.83,79.33 R2.1
N$6
  Top 0.2: IC3.6 41.73,64.42 41.83,64.33 41.83,63.77 43.05,62.55 43.6,62.55 IC3.1 47.2,61.88 R16.2
N$7  (via drill 0.35)
  Top 0.2: v30.11,79.03 30.62,79.03 30.92,79.32 | 34.56,81.82 35.45,81.82 35.89,82.27 | 37.23,83.6 37.99,84.36 37.99,85.89 37.7,86.18 | 31.89,81.19 32.53,81.82 33.29,81.82 | 35.7,88.68 35.7,88.17 36.15,87.73 | 34.99,72.12 35.28,71.83 35.69,71.83
  Top 0.203: TC1.2 35.7,88.68 | 37.23,83.6 35.89,82.27 | 31.89,81.19 31.64,80.93 arc45 31.38,80.32 31.38,79.79 | 31.38,79.79 IC1.1 | 33.29,81.82 34.56,81.82 | 35.69,71.83 TR1.3 | v30.24,76.87 34.99,72.12 | 30.92,79.32 31.38,79.79 | 36.15,87.73 37.7,86.18
  Bottom 0.203: v30.24,76.87 30.24,78.72 arc45 v30.11,79.03
N$8
  Top 0.203: R6.2 42.16,73.61 arc-45 42.45,72.9 TR1.1
N$9
  Top 0.2: 59.91,97.26 59.62,96.97 59.2,96.97
  Top 0.203: 59.2,96.97 R3.2 | 1V/OCT.TIP 59.91,97.26
N$10  (via drill 0.35)
  Top 0.2: TR1.2 38.94,71.83 38.54,71.43 38.54,71.38 37.9,70.74 37,70.74 36.96,70.77 33.42,70.77 v27.57,76.61 | TP1.1 32.41,91.8 32.41,92.09 31.5,93 v29.23,93
  Bottom 0.2: v27.57,76.61 27.57,88.68 28.46,89.57 28.46,92.24 v29.23,93
N$11
  Top 0.2: 10.72,84.02 10.43,83.73 10.02,83.73 | 12.55,85.85 12.84,86.14 12.84,86.55 | 5.69,84.02 5.99,83.73 6.4,83.73 | R11.2 1.83,87.88 2.49,87.22
  Top 0.203: 12.55,85.85 T1.D 10.72,84.02 | 12.84,86.55 C7.2 | 2.49,87.22 5.69,84.02 | 6.4,83.73 10.02,83.73
N$12  (via drill 0.35)
  Top 0.2: R5.1 58.4,52.45 58.4,54.41 47.72,65.09 43.05,65.09 41.48,66.65 41.48,69.37 40.48,70.37 32.78,70.37 26.37,76.78 26.37,77.44 v26.3,77.5 | v26.79,79.79 27.26,80.27 R4.1 | 32.8,82.71 33.16,82.71 33.42,82.96 | 33.51,88.38 33.51,88.79 33.22,89.09 | 30.01,82.42 30.3,82.71 30.72,82.71
  Top 0.203: C3.1 33.51,87.5 | 33.51,87.5 33.63,87.38 arc-45 33.92,86.68 IC1.6 33.92,83.89 arc-45 33.63,83.18 33.42,82.96 | 33.22,89.09 TP1.6 | 33.51,87.5 33.51,88.38 | 30.72,82.71 32.8,82.71 | R4.1 30.01,82.42
  Bottom 0.2: v26.3,77.5 26.56,77.76 26.56,79.79 v26.79,79.79
N$13  (via drill 0.35)
  Top 0.2: TP1.3 29.48,91.66 29.34,91.8 26.3,91.8 26.23,91.73 24.78,91.73 v20.21,87.16 | 9.03,90.08 12.72,90.08 16.11,86.68 16.75,86.68 17.22,87.16 v18.56,87.16 | 8.74,89.02 9.03,89.31 9.03,89.73 | 8.74,94.18 9.03,93.89 9.03,93.47 | 9.41,85.98 9.41,86.39 9.12,86.69
  Top 0.203: 9.12,86.69 C7.1 8.74,89.02 | T1.S 9.41,85.98 | IC2.2 8.53,94.39 8.74,94.18 | 9.03,89.73 9.03,90.08 9.03,93.47
  Bottom 0.2: v20.21,87.16 v18.56,87.16
N$14
  Top 0.2: IC6.2 16.75,44.58 16.75,45.13 16.7,45.19 C17.1 16.57,47.02 R44.2 16.64,49.69 17.7,50.74 19.25,50.74 19.42,50.57 19.42,49.97 20.46,48.93 20.46,44.61 21.93,43.15 30.57,43.15 31.98,44.56 31.98,44.61 32.62,45.25 33.53,45.25 34.48,44.29 34.48,43.7 35.12,43.07 35.6,43.07 40.91,37.75 40.91,34.18 39.24,32.51 R38.2 37.54,33.48 TP2.6
N$15
  Top 0.2: FM_LEVEL.P$3 59.24,45.6 60.48,44.36 61.52,44.36 62.24,45.09 62.24,46.51 63.77,48.04 63.77,51.68 63.6,51.85 63.6,53.35 63.77,53.52 63.77,75.2 LIN.TIP
N$16
  Top 0.2: C8.1 17.41,91.23 17.85,90.79 17.85,89.22 17.67,89.05 16.86,89.05 16.68,89.22 16.68,90.17 15.64,91.22 13.28,91.22 IC2.5 | R12.2 9.79,96.65 9.79,93.38 11.32,91.85 11.73,91.85
  Top 0.203: 11.73,91.85 IC2.5
N$17
  Top 0.2: R5.2 61,47.95 FM_LEVEL.P$2
N$18
  Top 0.2: 31.48,88.68 31.24,88.92 TP1.4 TP1.5 | 32.66,86.05 32.66,86.46 32.36,86.75
  Top 0.203: C3.2 31.48,87.63 | 32.36,86.75 31.48,87.63 | IC1.7 32.66,86.05 | 31.48,87.63 31.48,88.68
N$19  (via drill 0.35)  (1 unrouted)
  Top 0.2: IC5.6 52.4,37.75 | 50.56,39.98 IC5.7 v50.56,35.34 | TR4.2 TR4.1 49.87,44.16 v49.93,44.1
  Bottom 0.2: v49.93,44.1 50.56,43.47 v50.56,35.34
N$20
  Top 0.2: 16.78,86.14 18.58,86.14 19.32,86.88 19.32,89.09 | 15.42,86.14 15,86.14 14.71,85.85 | 11.22,83.09 10.81,83.09 T1.G | 16.81,97.6 17.39,97.03 17.39,96.61
  Top 0.203: IC2.7 16.68,94.39 arc-45 17.39,94.1 | 17.39,94.1 C8.2 arc-45 17.96,93.85 19.32,92.49 19.32,89.09 | R8.2 16.81,97.6 | 17.39,96.61 17.39,94.1 | 11.22,83.09 11.95,83.09 14.71,85.85 | 16.78,86.14 15.42,86.14
N$21
  Top 0.2: SYNC.TIP 59.16,7.56 C4.1
N$22  (via drill 0.35)
  Top 0.2: C4.2 66.94,17.05 67.2,17.31 67.2,96.68 64.31,99.57 13.46,99.57 v12.97,99.08 | v10.94,93.76 12.01,93.76 IC2.6 | R7.1 16.36,92.28 16.36,91.4 17.27,90.5 IC8.1
  Top 0.203: R7.1 13.38,93.44 arc45 12.68,93.15 IC2.6
  Bottom 0.2: v12.97,99.08 10.94,97.05 v10.94,93.76
N$23
  Top 0.203: R13.1 20.78,67.09 TR2.2
N$24
  Top 0.203: IC4.2 13.82,63.18 14.38,63.18 14.96,63.76 14.96,65.77 16.02,66.83 R17.2 | R17.2 16.59,67.47 R13.2 18.5,68.87 R15.1 | R14.1 14.81,68.1 R17.2
N$25
  Top 0.2: IC7.7 IC7.6
N$28
  Top 0.203: C13.2 R23.1 20.02,60.61 R20.1
N$29
  Top 0.2: R30.1 57.42,41.4 TR3.2
N$30
  Top 0.203: R25.2 7.32,63.79 IC4.6 7.29,64.45 6.73,64.45 6.55,64.63 6.55,65.48 6.94,65.87 R24.1
N$31
  Top 0.203: R27.2 R25.1 5.14,60.26 arc45 5.85,59.96 D4.A 6.55,60.66 6.55,61.67 6.73,61.85 7.75,61.85 7.96,62.06 IC4.7
N$33
  Top 0.2: R26.1 9.43,57.57 8.57,56.71 7.11,56.71 D4.C
  Top 0.203: R28.1 3.74,57.96 D4.C | R26.1 16.14,60.67 D3.C 17.5,60.88 R23.2
N$34
  Top 0.2: IC5.2 51.23,31.31 51.23,30.75 52.27,29.71 R32.2 C14.1 52.59,26.39 R31.2 55.39,26.64 R30.2 57.42,26.71 56.37,27.77 56.37,41.6 53.1,44.87 40.91,44.87 40.16,45.62 32.47,45.62 30.4,43.55 22.54,43.55 20.87,45.22 20.87,49.1 19.83,50.13 19.83,50.73 19.41,51.15 17.53,51.15 17.34,50.96 15.38,50.96 12.24,47.82 12.24,45.02 10.3,43.09 2.68,43.09 1.6,44.17 1.6,53.35 3.45,55.2 R28.2
N$36
  Top 0.2: R18.2 R19.1 37.5,64.68 37.85,65.03 38.41,65.03 IC3.5
N$37
  Top 0.2: R33.2 48.79,26.07 C14.2 50.37,27.72 | 50.37,27.72 R32.1 | IC5.1 49.96,31.31 49.96,30.75 50.37,30.34 50.37,27.72
N$38
  Top 0.2: SAW_MIX.P$2 62.18,12.24 R48.1
N$39
  Top 0.2: IC3.7 36.97,63.15 35.83,62.01 35.51,62.01 | 35.51,62.01 R21.2 | R19.2 35.51,62.65 35.51,62.01
N$40
  Top 0.2: R9.1 6.3,47.09 PULSE_WIDTH.P$2
N$41
  Top 0.2: PWM_IN.TIP 40.08,57.6 39.94,57.47 39.34,57.47 39.2,57.6 39.04,57.6 28.28,46.84 27.54,46.84 26.79,46.1 26.79,45.09 26.07,44.36 25.04,44.36 24.28,45.11 23.54,45.11 PWM_LEVEL.P$3
N$42
  Top 0.2: IC3.2 47.2,63.15 R16.1 47.51,63.4 48.57,62.34 48.57,60.79 48.39,60.62 43.71,60.62 41.78,62.55 37.91,62.55 37.67,62.31 37.67,58.62 36.26,57.21 32.01,57.21 28.15,53.35 28.15,51.47 R10.2 25.91,49.31 22.95,52.27 22.95,53.35 21.9,54.4 20.59,54.4 20.4,54.4 17.95,51.95 15.23,51.95 14.02,50.74 10.27,50.74 R9.2
N$43
  Top 0.2: TRI_MIX.P$2 43.25,13 R49.1
N$44
  Top 0.2: R50.1 6.94,11.92 PULSE_MIX.P$2
N$45
  Top 0.2: SINE_MIX.P$2 25.55,12.92 R51.1
N$46
  Top 0.2: PWM_LEVEL.P$2 25.55,47.84 R10.1
N$48  (via drill 0.35)
  Top 0.2: R52.1 11.86,26.61 | 11.86,26.61 12.65,25.82 IC7.2 16.17,25.1 16.66,25.1 16.85,24.9 16.85,23.14 18.62,21.37 26.74,21.37 v26.94,21.57 | R51.2 26.94,13.75 | 26.94,13.75 40.67,13.75 41.72,14.8 43.28,14.8 44.33,13.75 R49.2 v49.8,13.75 | v53.61,13.75 R48.2 | v26.94,18.83 26.94,13.75 | 11.86,26.61 8.84,23.59 R50.2
  Bottom 0.2: v49.8,13.75 v53.61,13.75 | v26.94,21.57 v26.94,18.83
N$49
  Top 0.2: IC7.1 13.29,27.09 R52.2 5.99,22.96 5.99,12.3 6.56,11.74 6.56,10.55 7.29,9.82 7.38,9.82 MIX.TIP
N$76
  Top 0.2: R37.1 36.21,35.38 TP2.1 35.71,35.52 35.71,37.24 33.08,39.87 TR4.3
N$77
  Top 0.2: TP2.5 35.2,32.72 R39.1 37.31,28.69 TR5.1
N$78
  Top 0.2: TP2.4 34.06,33.48 R39.2 32.31,31.74 TR5.3
N$79
  Top 0.2: TR5.2 34.81,24.6 R40.1
N$80
  Top 0.2: R42.1 34.19,35.98 34.88,35.98 35.06,35.81 35.06,35.52 TP2.2
N$82
  Top 0.2: TP2.3 32.22,35.38 R41.2 | R43.1 28.72,36.98 R41.2 | IC6.3 16.14,41.81 14.23,39.89 14.23,34.5 | 18.78,33.33 19.52,34.07 24.02,34.07 25.04,33.06 29.9,33.06 R41.2
  Top 0.203: 14.23,34.5 14.24,34.49 14.24,31.53 14.62,31.15 16.53,31.15 17.19,31.81 17.74,31.81 17.75,31.81 18.35,31.81 18.78,32.24 18.78,33.33
N$83
  Top 0.2: IC5.5 53.1,38.91 53.35,39.16 53.35,40.91 53.18,41.09 52.23,41.09 R36.1 48.09,42.44 R35.1
N$84
  Top 0.2: IC6.6 15.48,38.04 15.48,37.48 15.18,37.19 R46.2
  Top 0.203: R46.2 R45.2
PULSE  (via drill 0.35)
  Top 0.2: PULSE_MIX.P$3 5.3,36.8 PULSE.TIP | R21.1 R22.2 24.55,59.6 20.26,55.31 14.83,55.31 14.67,55.46 12.51,55.46 10.4,53.35 10.4,53.09 v7.89,50.58
  Bottom 0.2: PULSE.TIP 7.8,43.84 6.56,45.09 6.56,49.12 8.02,50.58 v7.89,50.58
PULSEIN
  Top 0.2: R18.1 28.21,67.22 26.99,66 25.6,66 25.57,66.03 19.98,66.03 C13.1
  Top 0.203: 16.02,64.55 16.02,63.01 D3.A 14.79,62.88 14.56,62.65 14.56,62.09 14.38,61.91 13.82,61.91 IC4.1 11.19,61.25 10.43,62.01 10.43,66.26 R24.2 | 16.02,64.55 R17.1 | C13.1 17.73,64.55 16.02,64.55
SAW
  Top 0.2: SAW_MIX.P$3 59.24,11.06 60.48,9.82 61.52,9.82 62.24,10.55 62.24,11.74 63.6,13.09 63.6,36.7 SAW.TIP 54.15,46.16 53.63,46.16 52.99,46.8 52.99,47.38 52.03,48.34 48.63,48.34 48.59,48.3 44.09,48.3 43.73,47.94 32.15,47.94 28.16,43.95 22.94,43.95 21.81,45.09 21.81,49.32 19.58,51.55 15.4,51.55 11.84,47.98 11.84,45.38 10.81,44.36 2.81,44.36 2.81,49.06 5.48,51.72 5.48,56.68 4.84,57.31 2.56,57.31 1.54,58.33 1.54,65.82 2.81,67.09 5.41,67.09
  Top 0.203: R29.1 6.47,68.91 6.16,68.91 5.41,68.15 5.41,67.09 R27.1
SAWCORE
  Top 0.2: 4.02,93.7 3.45,93.13 1.05,93.13 0.81,92.89 0.81,86.68 R14.2 | 6.84,96.68 6.84,95.69 6.87,95.66 | IC2.1 5.99,95.66 5.69,95.37
  Top 0.203: R12.1 6.84,96.68 | IC2.1 6.87,95.66 | R11.1 3.73,92.99 arc-45 4.02,93.7 5.69,95.37
SINE  (via drill 0.35)
  Top 0.2: 17.11,35.39 17.41,35.7 IC6.7 18.08,39.38 18.08,39.94 19.93,41.79 22.67,41.79 23.1,41.36 23.1,40.57 24.96,38.71 SINE.TIP | 17.11,35.39 R46.1 | SINE_MIX.P$3 17.98,16.13 v17.98,18.83 | v18.05,32.55 17.11,33.49 17.11,35.39
  Bottom 0.2: v17.98,18.83 17.98,32.47 v18.05,32.55
SINE_PRE1
  Top 0.2: IC6.5 15.54,39.38 15.54,39.94 18.68,43.08 IC6.1 18.6,44 C17.2 18.47,47.02 R44.1
TRI  (via drill 0.35)
  Top 0.2: R35.2 46.18,42.23 TRI.TIP 46.99,35.56 47.31,35.56 48,34.88 48,32.47 47.01,31.48 47.01,31.28 | R34.1 47.01,31.28 | 47.01,31.28 47.83,30.45 47.83,28.99 | 47.83,28.99 R33.1 | v40.91,22.64 47.26,28.99 47.83,28.99
  Bottom 0.2: TRI_MIX.P$3 40.91,11.22 v40.91,22.64

### Text on the board
tPlace: Pure VCO V3.1 cc-by 4.0 2021 / The Little Red Hen
bPlace: Pure VCO V3.1 cc-by 4.0 2021 / The Little Red Hen